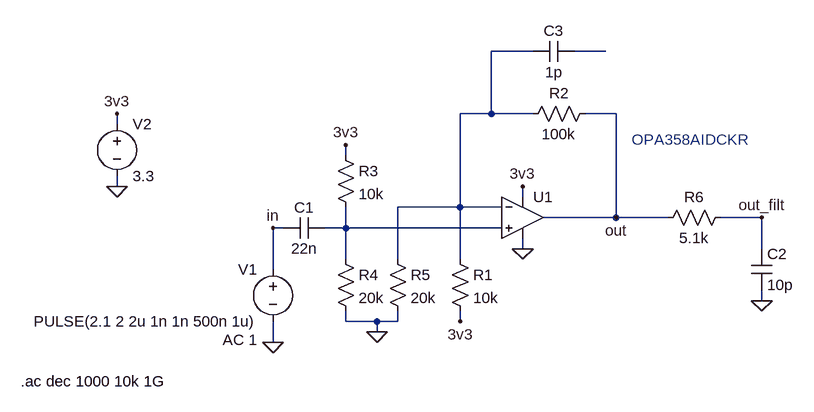
[diagram p0: schematic rf_det_out_amp_bodge_ac.asc]
rf_det_out_amp_bodge_ac.asc, the LTspice schematic file:
Version 4
SHEET 1 880 680
WIRE 320 -144 256 -144
WIRE 432 -144 384 -144
WIRE 256 -48 256 -144
WIRE 256 -48 208 -48
WIRE 320 -48 256 -48
WIRE 448 -48 400 -48
WIRE -320 -32 -320 -48
WIRE 32 16 32 0
WIRE -320 64 -320 48
WIRE 304 80 304 64
WIRE 208 96 208 -48
WIRE 208 96 112 96
WIRE 272 96 208 96
WIRE 448 112 448 -48
WIRE 448 112 336 112
WIRE 528 112 448 112
WIRE 672 112 608 112
WIRE -64 128 -80 128
WIRE 32 128 32 96
WIRE 32 128 0 128
WIRE 272 128 32 128
WIRE 304 160 304 144
WIRE 672 160 672 112
WIRE 32 176 32 128
WIRE 112 176 112 96
WIRE 208 176 208 96
WIRE -80 192 -80 128
WIRE 672 240 672 224
WIRE 32 272 32 256
WIRE 80 272 32 272
WIRE 112 272 112 256
WIRE 112 272 80 272
WIRE 208 272 208 256
WIRE 80 288 80 272
WIRE -80 304 -80 272
FLAG 304 64 3v3
FLAG 304 160 0
FLAG 448 112 out
FLAG -80 128 in
FLAG -320 64 0
FLAG -320 -48 3v3
FLAG 32 0 3v3
FLAG 208 272 3v3
FLAG 672 240 0
FLAG 672 112 out_filt
FLAG 80 288 0
FLAG -80 304 0
SYMBOL OpAmps\\UniversalOpAmp2 304 112 R0
SYMATTR InstName U1
SYMATTR Value2 Avol=1Meg GBW=80Meg Slew=55Meg
SYMBOL cap 0 112 R90
WINDOW 0 0 32 VBottom 2
WINDOW 3 32 32 VTop 2
SYMATTR InstName C1
SYMATTR Value 22n
SYMBOL res 192 160 R0
SYMATTR InstName R1
SYMATTR Value 10k
SYMBOL res 416 -64 R90
WINDOW 0 0 56 VBottom 2
WINDOW 3 32 56 VTop 2
SYMATTR InstName R2
SYMATTR Value 100k
SYMBOL voltage -80 176 M0
WINDOW 123 24 124 Left 2
WINDOW 39 0 0 Left 0
SYMATTR Value2 AC 1
SYMATTR InstName V1
SYMATTR Value PULSE(2.1 2 2u 1n 1n 500n 1u)
SYMBOL voltage -320 -48 R0
WINDOW 123 0 0 Left 0
WINDOW 39 0 0 Left 0
SYMATTR InstName V2
SYMATTR Value 3.3
SYMBOL res 16 0 R0
SYMATTR InstName R3
SYMATTR Value 10k
SYMBOL cap 656 160 R0
SYMATTR InstName C2
SYMATTR Value 10p
SYMBOL res 16 160 R0
SYMATTR InstName R4
SYMATTR Value 20k
SYMBOL res 96 160 R0
SYMATTR InstName R5
SYMATTR Value 20k
SYMBOL res 624 96 R90
WINDOW 0 0 56 VBottom 2
WINDOW 3 32 56 VTop 2
SYMATTR InstName R6
SYMATTR Value 5.1k
SYMBOL cap 384 -160 R90
WINDOW 0 0 32 VBottom 2
WINDOW 3 32 32 VTop 2
SYMATTR InstName C3
SYMATTR Value 1p
TEXT 472 -8 Left 2 ;OPA358AIDCKR
TEXT -468 364 Left 2 !.ac dec 1000 10k 1G

The netlist it stands for:
* rf_det_out_amp_bodge_ac.asc
XU1 N003 N001 3v3 0 out level2 Avol=1Meg GBW=80Meg Slew=55Meg Ilimit=25m Rail=0 Vos=0 En=0 Enk=0 In=0 Ink=0 Rin=500Meg  ; pins In+ In- V+ V- OUT
C1 N003 in 22n
R1 N001 3v3 10k
R2 out N001 100k
V1 in 0 PULSE(2.1 2 2u 1n 1n 500n 1u) AC 1
V2 3v3 0 3.3
R3 3v3 N003 10k
C2 out_filt 0 10p
R4 N003 0 20k
R5 N001 0 20k
R6 out_filt out 5.1k
C3 N002 N001 1p
* OPA358AIDCKR
.ac dec 1000 10k 1G
.lib UniversalOpAmp2.lib
.backanno
.end